# EAGLE schematic NIGHT-LIGHT-TIMER (EAGLE 7.7.0)
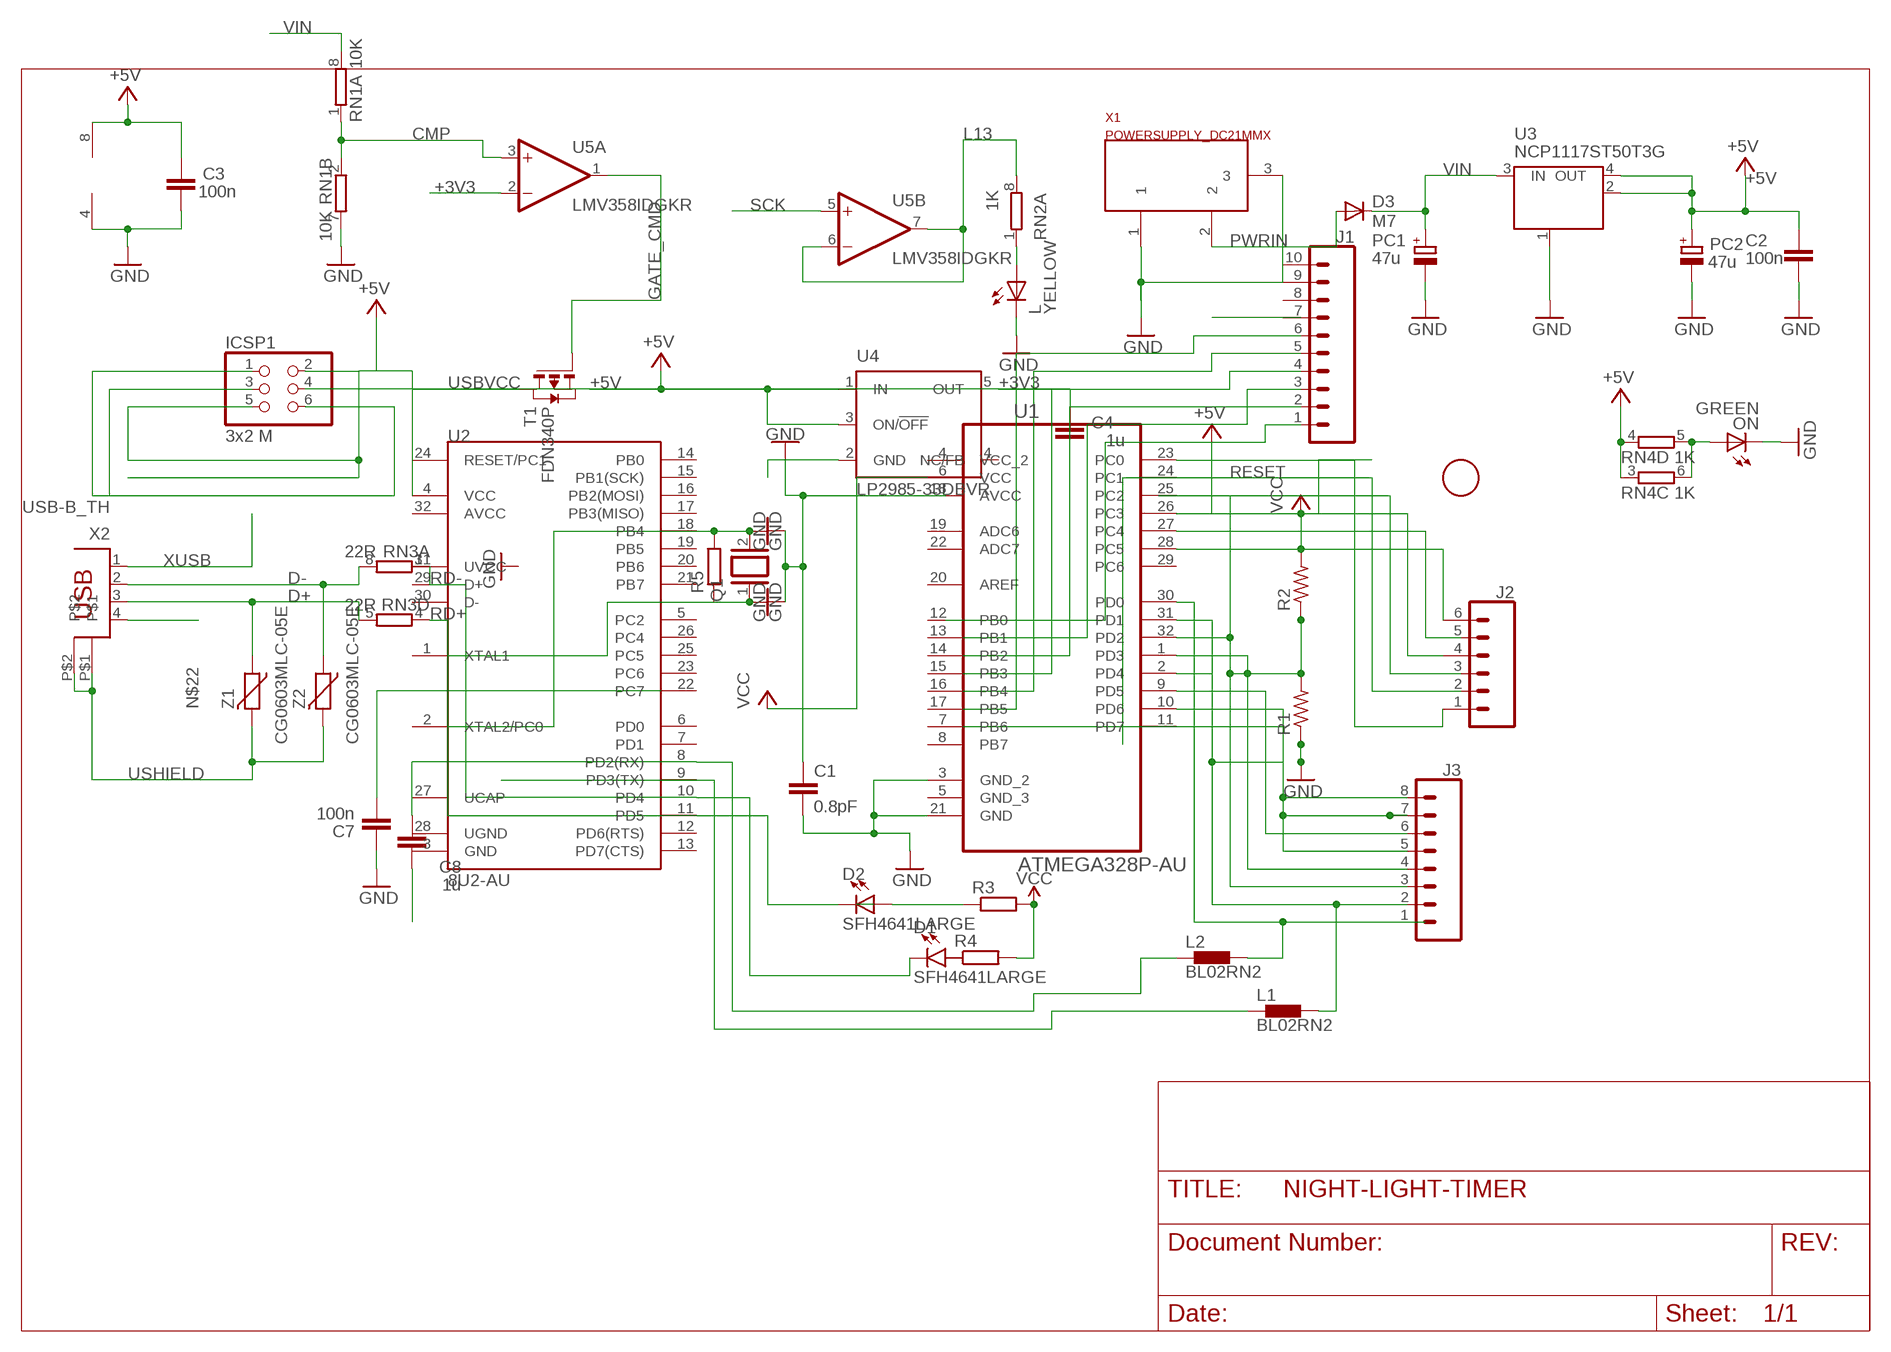
[diagram p0: schematic, sheet 1]

## Parts
C1  0.8pF  0.8PF-0402-50V-0.1PF  [0402]
C2  100n  C-EU0603-RND  [C0603-ROUND]
C3  100n  C-EU0603-RND  [C0603-ROUND]
C4  1u  C-EU0603-RND  [C0603-ROUND]
C7  100n  C-EU0603-RND  [C0603-ROUND]
C8  1u  C-EU0603-RND  [C0603-ROUND]
D1  SFH4641LARGE  [SFH4641]
D2  SFH4641LARGE  [SFH4641]
D3  M7  DIODE-SMB  [SMB]
FD1  FIDUCIALMOUNT  [FIDUCIA-MOUNT]
ICSP1  3x2 M  PINHD-2X3  [2X03]
J1  CONN_10LOCK  [1X10_LOCK]
J2  CONN_06POGOPIN_HOLES_ONLY  [1X06_HOLES_ONLY]
J3  CONN_08FEMALE_LOCK  [1X08_FEMALE_LOCK]
L  YELLOW  LEDCHIP-LED0805  [CHIP-LED0805]
L1  BL02RN2  [BL02RN2]
L2  BL02RN2  [BL02RN2]
ON  GREEN  LEDCHIP-LED0805  [CHIP-LED0805]
PC1  47u  CPOL-EUD  [PANASONIC_D]
PC2  47u  CPOL-EUD  [PANASONIC_D]
Q1  XTAL  [Q]
R1  R-US_0204/5  [0204/5]
R2  R-US_0207/7  [0207/7]
R3  R-EU_R2512  [R2512]
R4  R-EU_R2512  [R2512]
R5  R-EU_R2512  [R2512]
RN1  10K  4R-NCAY16  [CAY16]
RN2  1K  4R-NCAY16  [CAY16]
RN3  22R  4R-NCAY16  [CAY16]
RN4  1K  4R-NCAY16  [CAY16]
T1  FDN340P  PMOSSOT23  [SOT-23]
U1  ATMEGA328P-AU  [QFP80P900X900X120-32N]
U2  8U2-AU  ATMEGA8U2AU  [TQFP32-08_MCU]
U3  NCP1117ST50T3G  MC33269ST-3.3T3  [SOT223]
U4  LP2985-33DBVR  LP2985-XXDBVR33  [SOT23-DBV]
U5  LMV358IDGKR  LMV358MMX  [MSOP08]
X1  POWERSUPPLY_DC21MMX  [POWERSUPPLY_DC-21MM]
X2  USB-B_TH  PN61729  [PN61729]
Z1  CG0603MLC-05E  VARISTORCN0603  [CT/CN0603]
Z2  CG0603MLC-05E  VARISTORCN0603  [CT/CN0603]

## Nets
+3V3: C4.2 U4.5(OUT) U5.2(A:-IN)
+5V [usbvcc]: C2.2 C3.2 PC2.+ RN4.3 RN4.4 T1.2(S) U3.2(OUT) U3.4(OUT) U4.1(IN) U4.3(ON/!OFF) U5.8(P:V+)
+5V1 [usbvcc]: C7.1
CMP: RN1.1 RN1.2 U5.3(A:+IN)
D+: RN3.5 X2.3 Z1.1
D-: RN3.8 X2.2 Z2.1
GATE_CMD: T1.3(G) U5.1(A:OUT)
GND: C1.1 C1.2 C2.1 C3.1 C4.1 C7.2 L.C ON.C PC1.- PC2.- Q1.1 Q1.2 R1.1 R5.2 RN1.7 U1.3(GND_2) U1.21(GND) U3.1(GND/ADJ) U4.2(GND) U5.4(P:V-) X1.1 X1.3
L13: RN2.8 U5.6(B:-IN) U5.7(B:OUT)
LIGHT_SENSOR: R1.2 R2.1 U1.1(PD3) U1.25(PC2) U1.32(PD2)
MISO2: ICSP1.1 ICSP1.6
MOSI2: ICSP1.4
N$7: ON.A RN4.5 RN4.6
N$8: J2.1 U1.23(PC0)
N$9: U1.24(PC1)
N$11: J2.4 U1.26(PC3)
N$12: U1.27(PC4)
N$13: J2.6 U1.28(PC5)
N$14: D1.C U2.10(PD4)
N$15: J3.7 L1.2 U1.2(PD4) U1.10(PD6) U1.31(PD1)
N$16: U1.9(PD5)
N$17: D2.C U2.11(PD5)
N$18: L2.2 U1.30(PD0)
N$19: L1.1 U2.9(PD3(TX))
N$20: L2.1 U2.8(PD2(RX))
N$21: L.A RN2.1
N$22 [gnd]: X2.4
N$23: D2.A R3.1
PWRIN [power]: D3.A X1.2
RD+: RN3.4
RD-: RN3.1
RESET2: ICSP1.2 ICSP1.5 U2.4(VCC)
SCK: U5.5(B:+IN)
SCK2: ICSP1.3
TP_VUCAP: C8.1
UGND [gnd]: C8.2
USBVCC [usbvcc]: T1.1(D)
USHIELD [gnd]: X2.P$1 X2.P$2 Z1.2 Z2.2
VCC: R2.2 R3.2 R4.2 U1.6(VCC)
VIN [power]: D3.C PC1.+ RN1.8 U3.3(IN)
XUSB [usbvcc]: X2.1
Unconnected: D1.A J1.1 J1.2 J1.3 J1.4 J1.5 J1.6 J1.7 J1.8 J1.9 J1.10 J2.2 J2.3 J2.5 J3.1 J3.2 J3.3 J3.4 J3.5 J3.6 J3.8 R4.1 R5.1 RN1.3 RN1.4 RN1.5 RN1.6 RN2.2 RN2.3 RN2.4 RN2.5 RN2.6 RN2.7 RN3.2 RN3.3 RN3.6 RN3.7 RN4.1 RN4.2 RN4.7 RN4.8 U1.5(GND_3) U1.7(PB6) U1.8(PB7) U1.11(PD7) U1.12(PB0) U1.13(PB1) U1.14(PB2) U1.15(PB3) U1.16(PB4) U1.17(PB5) U1.19(ADC6) U1.20(AREF) U1.22(ADC7) U1.29(PC6) U2.1(XTAL1) U2.2(XTAL2/PC0) U2.3(GND) U2.5(PC2) U2.6(PD0) U2.7(PD1) U2.12(PD6(RTS)) U2.13(PD7(CTS)) U2.14(PB0) U2.15(PB1(SCK)) U2.16(PB2(MOSI)) U2.17(PB3(MISO)) U2.18(PB4) U2.19(PB5) U2.20(PB6) U2.21(PB7) U2.22(PC7) U2.23(PC6) U2.24(RESET/PC1) U2.25(PC5) U2.26(PC4) U2.27(UCAP) U2.28(UGND) U2.29(D+) U2.30(D-) U2.31(UVCC) U2.32(AVCC) U4.4(NC/FB)

## Power pins joined to a net without a drawn wire
AVCC: U1.18(AVCC)
VCC_2: U1.4(VCC_2)

## Library data of the parts
C1 = SparkFun-Capacitors:0.8PF: 0.8pF ceramic capacitors A capacitor is a passive two-terminal electrical component used to store electrical energy temporarily in an electric field.; PROD_ID: CAP-13456
C2-C4 C7 C8 = SmartPrj:C-EU: CAPACITOR, European symbol
D1 D2 = SparkFun-LED:SFH4641: OSRAM SFH 4641-Z - Infrared Emitters - High Power Infrared 940nm Wavelength:950nm Beam Angle:20 degree Forward Current:70mA Forward Voltage:1.6V Variants: Large:Large pads Narrow:Narrow pads Oversize:Oversize pads Short:Short pads Short2:Short, wide pads SparkFun Products: ZX Distance and Gesture Sensor <[https://www.sparkfun.com/products/13162]>; PROD_ID: DIO-11994
D3 = diode:DIODE-: DIODE
FD1 = SmartPrj:FIDUCIALMOUNT
ICSP1 = SmartPrj:PINHD-2X3: PIN HEADER
J1 = SparkFun-Connectors:CONN_10: Multi connection point. Often used as Generic Header-pin footprint for 0.1 inch spaced/style header connections On any of the 0.1 inch spaced packages, you can populate with these: Break Away Headers - Straight <https://www.sparkfun.com/products/116> (PRT-00116) Break Away Male Headers - Right Angle <https://www.sparkfun.com/products/553> (PRT-00553) Female Headers <https://www.sparkfun.com/products/115> (PRT-00115) Break Away Headers - Machine Pin <https://www.sparkfun.com/products/117> (PRT-00117) Break Away Female Headers - Swiss Machine Pin <https://www.sparkfun.com/products/743> (PRT-00743) Arduino Stackable Header - 10 Pin <https://www.sparkfun.com/products/11376> (PRT-11376) For SCREWTERMINALS and SPRING TERMINALS visit here: Screw Terimnals on SparkFun.com <https://www.sparkfun.com/search/results?term=Screw+Terminals> (5mm/3.5mm/2.54mm spacing) This device is also useful as a general connection point to wire up your design to another part of your project. Our various solder wires solder well into these plated through hole pads. Hook-Up Wire - Assortment (Stranded, 22 AWG) <https://www.sparkfun.com/products/11375> (PRT-11375) Hook-Up Wire - Assortment (Solid Core, 22 AWG) <https://www.sparkfun.com/products/11367> (PRT-11367) View the entire wire category on our website here <https://www.sparkfun.com/categories/141> Special notes: Molex polarized connector foot print use with SKU : PRT-08231 with associated crimp pins and housings. 1MM SMD Version SKU: PRT-10208 NOTES ON THE VARIANTS LOCK and LOCK_LONGPADS... This footprint was designed to help hold the alignment of a through-hole component (i.e. 6-pin header) while soldering it into place. You may notice that each hole has been shifted either up or down by 0.005 of an inch from it's more standard position (which is a perfectly straight line). This slight alteration caused the pins (the squares in the middle) to touch the edges of the holes. Because they are alternating, it causes a "brace" to hold the component in place. 0.005 has proven to be the perfect amount of "off-center" position when using our standard breakaway headers. Although looks a little odd when you look at the bare footprint, once you have a header in there, the alteration is very hard to notice. Also,if you push a header all the way into place, it is covered up entirely on the bottom side.
J2 = SparkFun-Connectors:CONN_06: Multi connection point. Often used as Generic Header-pin footprint for 0.1 inch spaced/style header connections On any of the 0.1 inch spaced packages, you can populate with these: Break Away Headers - Straight <https://www.sparkfun.com/products/116> (PRT-00116) Break Away Male Headers - Right Angle <https://www.sparkfun.com/products/553> (PRT-00553) Female Headers <https://www.sparkfun.com/products/115> (PRT-00115) Break Away Headers - Machine Pin <https://www.sparkfun.com/products/117> (PRT-00117) Break Away Female Headers - Swiss Machine Pin <https://www.sparkfun.com/products/743> (PRT-00743) Arduino Stackable Header - 6 Pin <https://www.sparkfun.com/products/9280> (PRT-09280) For SCREWTERMINALS and SPRING TERMINALS visit here: Screw Terimnals on SparkFun.com <https://www.sparkfun.com/search/results?term=Screw+Terminals> (5mm/3.5mm/2.54mm spacing) This device is also useful as a general connection point to wire up your design to another part of your project. Our various solder wires solder well into these plated through hole pads. Hook-Up Wire - Assortment (Stranded, 22 AWG) <https://www.sparkfun.com/products/11375> (PRT-11375) Hook-Up Wire - Assortment (Solid Core, 22 AWG) <https://www.sparkfun.com/products/11367> (PRT-11367) View the entire wire category on our website here <https://www.sparkfun.com/categories/141>; PROD_ID: CONN-08437
J3 = SparkFun-Connectors:CONN_08: Multi connection point. Often used as Generic Header-pin footprint for 0.1 inch spaced/style header connections On any of the 0.1 inch spaced packages, you can populate with these: Break Away Headers - Straight <https://www.sparkfun.com/products/116> (PRT-00116) Break Away Male Headers - Right Angle <https://www.sparkfun.com/products/553> (PRT-00553) Female Headers <https://www.sparkfun.com/products/115> (PRT-00115) Break Away Headers - Machine Pin <https://www.sparkfun.com/products/117> (PRT-00117) Break Away Female Headers - Swiss Machine Pin <https://www.sparkfun.com/products/743> (PRT-00743) Arduino Stackable Header - 8 Pin <https://www.sparkfun.com/products/9279> (PRT-09279) For SCREWTERMINALS and SPRING TERMINALS visit here: Screw Terimnals on SparkFun.com <https://www.sparkfun.com/search/results?term=Screw+Terminals> (5mm/3.5mm/2.54mm spacing) This device is also useful as a general connection point to wire up your design to another part of your project. Our various solder wires solder well into these plated through hole pads. Hook-Up Wire - Assortment (Stranded, 22 AWG) <https://www.sparkfun.com/products/11375> (PRT-11375) Hook-Up Wire - Assortment (Solid Core, 22 AWG) <https://www.sparkfun.com/products/11367> (PRT-11367) View the entire wire category on our website here <https://www.sparkfun.com/categories/141> Special notes: Molex polarized connector foot print use with SKU : PRT-08231 with associated crimp pins and housings. 1MM SMD Version SKU: PRT-10208 NOTES ON THE VARIANTS LOCK and LOCK_LONGPADS... This footprint was designed to help hold the alignment of a through-hole component (i.e. 6-pin header) while soldering it into place. You may notice that each hole has been shifted either up or down by 0.005 of an inch from it's more standard position (which is a perfectly straight line). This slight alteration caused the pins (the squares in the middle) to touch the edges of the holes. Because they are alternating, it causes a "brace" to hold the component in place. 0.005 has proven to be the perfect amount of "off-center" position when using our standard breakaway headers. Although looks a little odd when you look at the bare footprint, once you have a header in there, the alteration is very hard to notice. Also,if you push a header all the way into place, it is covered up entirely on the bottom side.; PROD_ID: CONN-09233; SF_ID: PRT-09279
L ON = led:LED: LED OSRAM: - CHIPLED LG R971, LG N971, LY N971, LG Q971, LY Q971, LO R971, LY R971 LH N974, LH R974 LS Q976, LO Q976, LY Q976 LO Q996 - Hyper CHIPLED LW Q18S LB Q993, LB Q99A, LB R99A - SideLED LS A670, LO A670, LY A670, LG A670, LP A670 LB A673, LV A673, LT A673, LW A673 LH A674 LY A675 LS A676, LA A676, LO A676, LY A676, LW A676 LS A679, LY A679, LG A679 - Hyper Micro SIDELED® LS Y876, LA Y876, LO Y876, LY Y876 LT Y87S - SmartLED LW L88C, LW L88S LB L89C, LB L89S, LG L890 LS L89K, LO L89K, LY L89K LS L896, LA L896, LO L896, LY L896 - TOPLED LS T670, LO T670, LY T670, LG T670, LP T670 LSG T670, LSP T670, LSY T670, LOP T670, LYG T670 LG T671, LOG T671, LSG T671 LB T673, LV T673, LT T673, LW T673 LH T674 LS T676, LA T676, LO T676, LY T676, LB T676, LH T676, LSB T676, LW T676 LB T67C, LV T67C, LT T67C, LS T67K, LO T67K, LY T67K, LW E67C LS E67B, LA E67B, LO E67B, LY E67B, LB E67C, LV E67C, LT E67C LW T67C LS T679, LY T679, LG T679 LS T770, LO T770, LY T770, LG T770, LP T770 LB T773, LV T773, LT T773, LW T773 LH T774 LS E675, LA E675, LY E675, LS T675 LS T776, LA T776, LO T776, LY T776, LB T776 LHGB T686 LT T68C, LB T68C - Hyper Mini TOPLED® LB M676 - Mini TOPLED Santana® LG M470 LS M47K, LO M47K, LY M47K Source: http://www.osram.convergy.de LUXEON: - LUMILED® LXK2-PW12-R00, LXK2-PW12-S00, LXK2-PW14-U00, LXK2-PW14-V00 LXK2-PM12-R00, LXK2-PM12-S00, LXK2-PM14-U00 LXK2-PE12-Q00, LXK2-PE12-R00, LXK2-PE12-S00, LXK2-PE14-T00, LXK2-PE14-U00 LXK2-PB12-K00, LXK2-PB12-L00, LXK2-PB12-M00, LXK2-PB14-N00, LXK2-PB14-P00, LXK2-PB14-Q00 LXK2-PR12-L00, LXK2-PR12-M00, LXK2-PR14-Q00, LXK2-PR14-R00 LXK2-PD12-Q00, LXK2-PD12-R00, LXK2-PD12-S00 LXK2-PH12-R00, LXK2-PH12-S00 LXK2-PL12-P00, LXK2-PL12-Q00, LXK2-PL12-R00 Source: www.luxeon.com KINGBRIGHT: KA-3528ASYC Source: www.kingbright.com
L1 L2 = inductors:BL0: Noise Suppression Products/EMI Suppression Filters, Lead EMIFIL(R) Inductor Type Source: http://www.murata.com .. BL01RN1_DS.pdf
PC1 PC2 = rcl:CPOL-EU: POLARIZED CAPACITOR, European symbol
Q1 = special:XTAL: CRYSTAL
R1 R2 = resistor:R-US_: RESISTOR, American symbol
R3-R5 = resistor:R-EU_: RESISTOR, European symbol
RN1-RN4 = resistor-dil:4R-N: Array Chip Resistor Source: RS Component / Phycomp
T1 = zetex:PMOSSOT23: MOS FET
U1 = Atmel_By_element14_Batch_1-00:ATMEGA328P-AU: 8-bit Microcontroller with In-System Programmable Flash; MPN: ATMEGA328P-AU; OC_FARNELL: 1715486; OC_NEWARK: 14R4631; PACKAGE: TQFP-32; SUPPLIER: Atmel
U2 = SparkFun-Retired:ATMEGA8U2: Atmel 32-pin 8-bit Microcontroller with 8/16/32K Bystes of ISP Flash and USB Controller. ATmega8U2, ATmega16U2, and ATmega32U2 Datasheet SparkFun Products Storefront component: ATMEGA8U2-AU <https://www.sparkfun.com/products/13703> (COM-13703); PROD_ID: IC-10104
U3 = linear:MC33269ST*: Adjustable Output Low Dropout Voltage Regulator 800 mA Source: http://www.onsemi.com/pub/Collateral/MC33269-D.PDF
U4 = SmartPrj:LP2985-XXDBVR: ULTRALOW-POWER 50-mA LOW-DROPOUT LINEAR REGULATORS 50-mA Low-Dropout Regulator Source: http://focus.ti.com/lit/ds/symlink/tps77001.pdf
U5 = linear:LMV358?*: Dual General Purpose, Low Voltage, Rail-to-Rail Output Operational Amplifiers Source: http://www.national.com/mpf/LM/LMV321.html http://www.national.com/dt/lmv_qual.pdf
X1 = SmartPrj:POWERSUPPLY_DC21MM
X2 = SmartPrj:PN61729: BERG USB connector
Z1 Z2 = varistor:VARISTOR: VARISTOR

## Net classes
0 default: width 0.254 mm, clearance 0.254 mm
1 power: width 0.61 mm, drill 0.61 mm, clearance 0.254 mm
2 gnd: width 0.305 mm, drill 0.559 mm, clearance 0.254 mm
3 usbvcc: width 0.508 mm, drill 0.61 mm, clearance 0.254 mm